# EAGLE design LVDS_CMOS_LVDT41v3 (EAGLE 8.3.2)
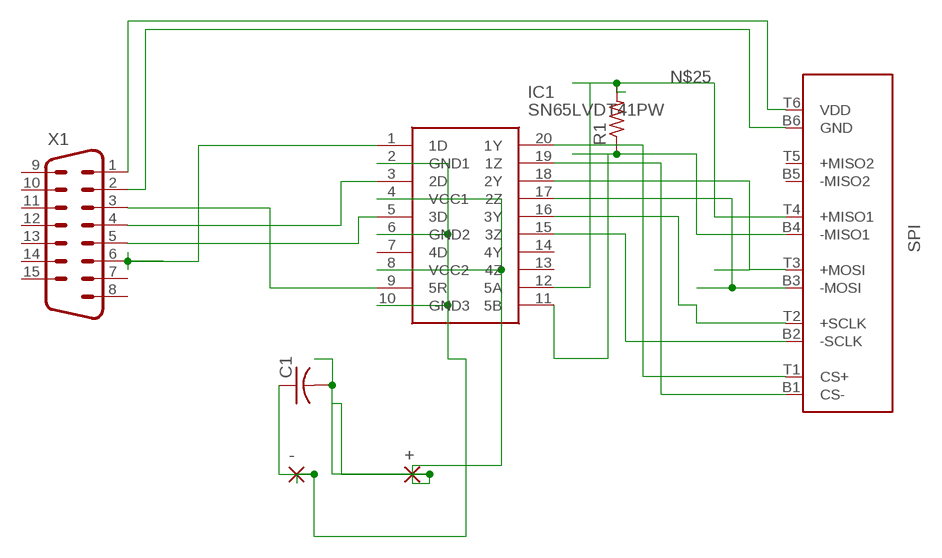
[diagram p0: schematic, sheet 1]

## Parts
+  3,17/1,3  [3,17/1,3]
-  3,17/1,3  [3,17/1,3]
C1  C-USC0805  [C0805]
IC1  SN65LVDT41PW  [SOP65P640X120-20N]
R1  R-US_R0603  [R0603]
SPI  SPI  OMNETICS-CONNECTOR-SLAVE-SIDE  [OMNETICS_PZN-12-AA-UPDATED]
X1  M15H  [M15H]

## Nets
BRD_GND [power]: -.1(P) C1.1 IC1.2(GND1) IC1.6(GND2) IC1.10(GND3)
N$1: SPI.T6(VDD) X1.1
N$2: SPI.B6(GND) X1.2
N$4: IC1.1(1D) X1.6
N$5: IC1.9(5R) X1.3
N$6: IC1.3(2D) X1.4
N$7: IC1.5(3D) X1.5
N$21: IC1.16(3Y) SPI.T2(+SCLK)
N$22: IC1.15(3Z) SPI.B2(-SCLK)
N$23: IC1.18(2Y) SPI.T3(+MOSI)
N$24: IC1.17(2Z) SPI.B3(-MOSI)
N$25: IC1.12(5A) R1.2 SPI.T4(+MISO1)
N$26: IC1.11(5B) R1.1 SPI.B4(-MISO1)
N$43: IC1.19(1Z) SPI.B1(CS-)
N$44: IC1.20(1Y) SPI.T1(CS+)
VDD-3.3V [power]: +.1(P) C1.2 IC1.4(VCC1) IC1.8(VCC2)
Unconnected: IC1.7(4D) IC1.13(4Z) IC1.14(4Y) SPI.B5(-MISO2) SPI.T5(+MISO2) X1.7 X1.8 X1.9 X1.10 X1.11 X1.12 X1.13 X1.14 X1.15

## Library data of the parts
+ - = wirepad:3,17/1,3: THROUGH-HOLE PAD
C1 = resistor:C-US: CAPACITOR, American symbol
IC1 = SamacSys_Parts:SN65LVDT41PW: Texas Instruments SN65LVDT41PW, LVDS Transceiver, 3 3.6 V, 20-Pin, TSSOP Source: Datasheet <http://www.ti.com/lit/gpn/sn65lvdt41>; ARROW_PART_NUMBER: SN65LVDT41PW; ARROW_PRICE/STOCK: https://www.arrow.com/en/products/sn65lvdt41pw/texas-instruments; DESCRIPTION: Texas Instruments SN65LVDT41PW, LVDS Transceiver, 3 3.6 V, 20-Pin, TSSOP; HEIGHT: 1.2mm; MANUFACTURER_NAME: Texas Instruments; MANUFACTURER_PART_NUMBER: SN65LVDT41PW; RS_PART_NUMBER: 1625262; RS_PRICE/STOCK: http://uk.rs-online.com/web/p/products/1625262
R1 = resistor:R-US_: RESISTOR, American symbol
SPI = headstage_isolation_board_3:OMNETICS-CONNECTOR-SLAVE-SIDE; OC_NEWARK: unknown
X1 = con-subd:M15: SUB-D; OC_FARNELL: unknown; OC_NEWARK: unknown

## Net classes
0 default: width 0.203 mm, drill 0.254 mm
1 power: width 0.381 mm

## Board
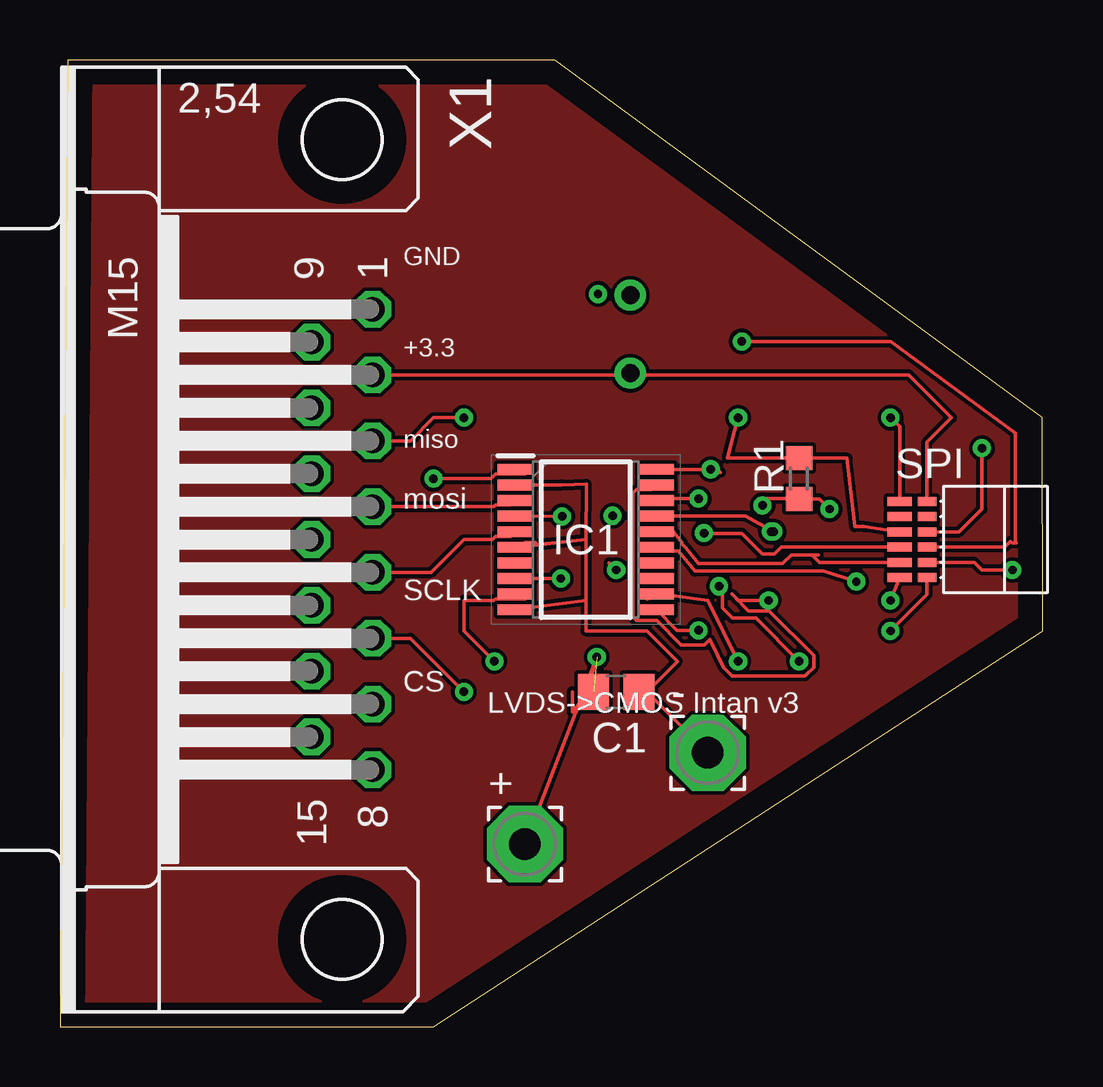
[diagram p1: board, top side]
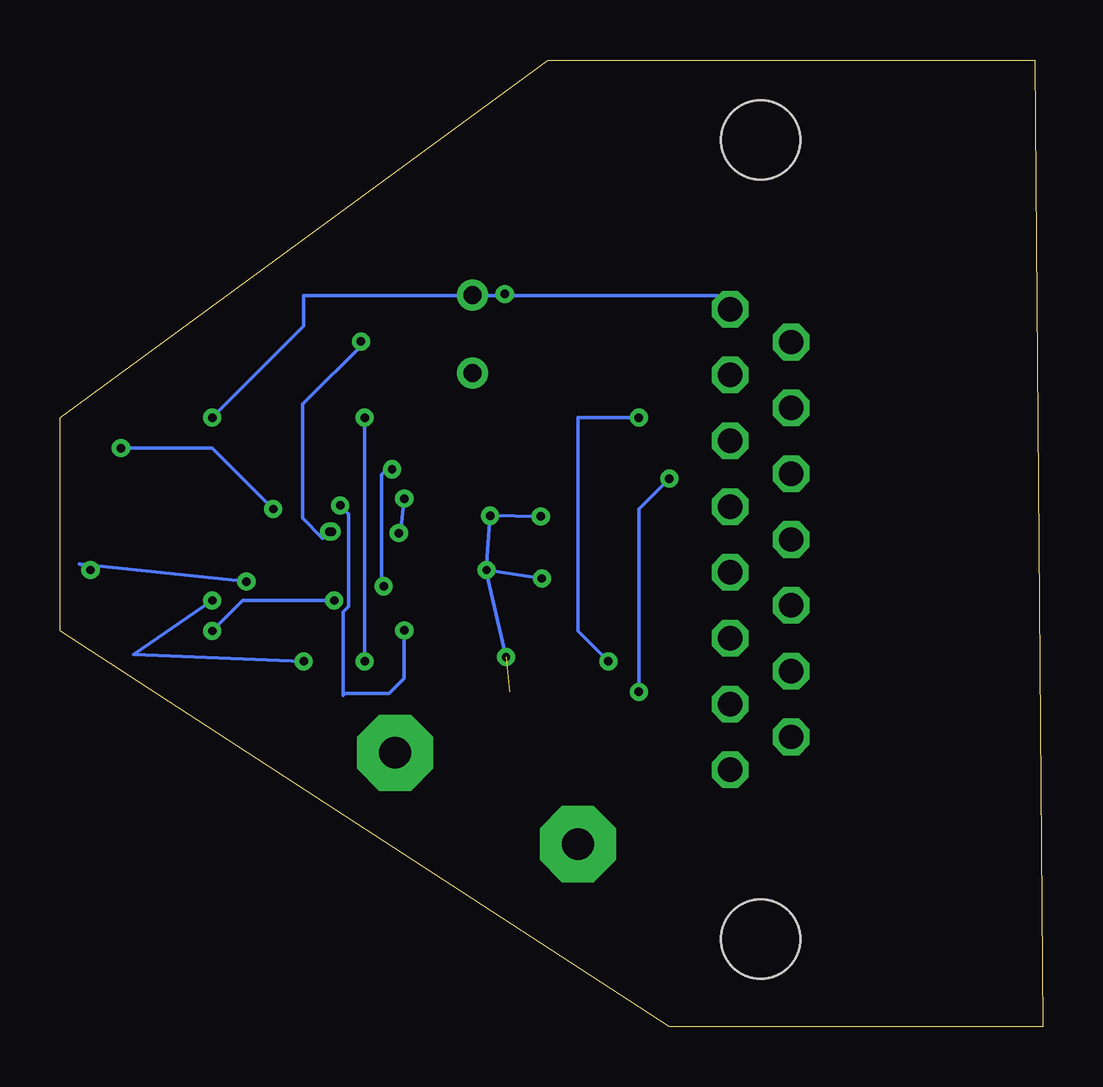
[diagram p2: board, bottom side, seen from below]

Size 40.97 x 40.31 mm. Coordinates in mm from the lower left corner, seen from the top.
Outline: 40.97,16.51 40.95,25.4 20.63,40.31 0.33,40.31 0,0 15.57,0 40.97,16.51
Copper layers (1*16): Top 0.035mm / dielectric 1.5mm / Bottom 0.035mm
Design rules "default": minimum track width 6mil, minimum drill 0.35mm, track to track 6mil, track to pad 6mil, pad to pad 6mil, via to via 6mil, smd to smd 6mil, copper to edge 40mil, drill to drill 6mil, minimum pad ring 10mil, minimum via ring 8mil, stop-mask expansion 4mil, vias tented up to drill 0mil, thermal gap 10mil

### Footprints (pad centres in the part's own frame; a part is rotated, then mirrored left to right if it is on the bottom)
3,17/1,3 = drill 1.321 pad 3.175 octagon: 1 0,0
C0805 = smd 1.3 x 1.5: 1 -0.95,0; 2 0.95,0
SOP65P640X120-20N = smd 1.475 x 0.45: 1 -2.938,2.925; 2 -2.938,2.275; 3 -2.938,1.625; 4 -2.938,0.975; 5 -2.938,0.325; 6 -2.938,-0.325; 7 -2.938,-0.975; 8 -2.938,-1.625; 9 -2.938,-2.275; 10 -2.938,-2.925; 11 2.938,-2.925; 12 2.938,-2.275; 13 2.938,-1.625; 14 2.938,-0.975; 15 2.938,-0.325; 16 2.938,0.325; 17 2.938,0.975; 18 2.938,1.625; 19 2.938,2.275; 20 2.938,2.925
R0603 = smd 1 x 1.1: 1 -0.85,0; 2 0.85,0
OMNETICS_PZN-12-AA-UPDATED = smd 0.381 x 0.762: B1 1.587,-1.016; B2 0.953,-1.016; B3 0.318,-1.016; B4 -0.318,-1.016; B5 -0.953,-1.016; B6 -1.587,-1.016 | smd 0.381 x 1.016: T1 1.587,-2.159; T2 0.953,-2.159; T3 0.318,-2.159; T4 -0.318,-2.159; T5 -0.953,-2.159; T6 -1.587,-2.159
M15H = drill 1.016 octagon: 1 -9.601,1.27; 2 -6.858,1.27; 3 -4.115,1.27; 4 -1.372,1.27; 5 1.372,1.27; 6 4.115,1.27; 7 6.858,1.27; 8 9.601,1.27; 9 -8.23,-1.27; 10 -5.486,-1.27; 11 -2.743,-1.27; 12 0,-1.27; 13 2.743,-1.27; 14 5.486,-1.27; 15 8.23,-1.27 | hole 3.302: 16.662,0; -16.662,0

### Placement (x,y rotation side)
+  19.38,7.62 0 top
-  27,11.43 0 top
C1  23.19,13.97 180 top
IC1  21.92,20.32 0 top
R1  30.81,22.86 90 top
SPI  37.16,20.32 270 top
X1  11.76,20.32 270 top

### Tracks (layer width: path | path; a pad name or v marks a point on that pad's centre or on a via)
BRD_GND
  Top 0.152: IC1.2 20.91,22.59 21.94,22.63 21.92,20.32 | 21.92,20.32 21.92,17.78 | 21.92,17.78 21.92,16.51 24.46,16.51 25.73,15.24 24.46,13.97 | C1.1 24.46,13.97 | 24.46,13.97 -.1 | 19.38,20.19 19.81,20.19 19.46,20.07 21.92,20.32 | IC1.6 21.92,20.32 | 21.92,17.78 IC1.10
N$1  (via drill 0.35)
  Top 0.152: SPI.T6 35,25.02 v34.62,25.4
  Bottom 0.152: v34.62,25.4 30.81,29.21 30.81,30.48 13.59,30.48 X1.1
N$2
  Top 0.152: SPI.B6 36.14,24.38 37.16,25.4 35.38,27.18 X1.2
N$3
  pour Top: 0.33,40.64 0.33,0 15.57,0 40.97,16.51 40.97,25.4 19.38,40.64
N$4  (via drill 0.35)
  Top 0.152: X1.6 14.6,16.2 v16.84,13.97 | IC1.1 19.18,23.05 19.38,23.05 18.15,23.05 17.96,22.86 v15.57,22.86
  Bottom 0.152: v16.84,13.97 16.84,21.59 v15.57,22.86
N$5  (via drill 0.35)
  Top 0.152: X1.3 14.6,24.43 15.57,25.4 v16.84,25.4 | v18.11,15.24 16.84,16.51 16.84,17.78 18.08,17.78 18.15,17.85 19.38,17.85 19.18,17.85 IC1.9
  Bottom 0.152: v16.84,25.4 19.38,25.4 19.38,16.51 v18.11,15.24
N$6
  Top 0.152: X1.4 18.09,21.69 18.15,21.75 18.79,21.75 IC1.3
N$7
  Top 0.152: X1.5 15.47,18.95 16.84,20.32 18.02,20.32 18.15,20.45 18.79,20.45 IC1.5
N$9  (via drill 0.35)
  other vias: 22.43,30.56
N$10  (via drill 0.75 pad 1.3)
  other vias: 23.77,27.25 23.77,30.51
N$21
  Top 0.152: IC1.16 24.98,20.6 25.54,20.7 25.94,20.2 25.94,20.13 26.01,20.04 26.09,19.96 26.61,19.33 30.12,19.33 30.48,19.68 31.34,19.68 | 31.34,19.68 31.61,19.68 | 31.34,19.68 31.66,19.37 SPI.T2
N$22  (via drill 0.35)
  Top 0.152: v39.7,19.05 38.43,19.05 38.11,19.37 SPI.B2 | v33.2,18.56 31.83,19 26.47,19 25.78,19.84 25.2,19.84 25.04,19.99 IC1.15
  Bottom 0.152: v33.2,18.56 40.16,19.3 v39.7,19.05
N$23  (via drill 0.35)
  Top 0.152: SPI.T3 30.08,20 29.79,19.71 29.29,19.71 28.43,20.57 26.82,20.57 26.75,20.65 v26.85,20.59 | IC1.18 24.94,22.02 v26.62,22.02
  Bottom 0.152: v26.85,20.59 26.77,20.59 v26.62,22.02 26.42,21.92
N$24  (via drill 0.35)
  Top 0.152: 29.32,20.7 v29.74,20.65 | SPI.B3 39.38,20 39.62,20.24 39.69,20.18 39.87,20.18 39.83,20.22 39.83,24.77 34.63,28.58 v28.42,28.58 | v29.74,20.65 28.56,21.29 IC1.17 | v29.74,20.65 v29.64,20.65
  Bottom 0.152: v29.64,20.65 30.02,20.37 30.86,21.21 30.86,25.96 28.22,28.6 28.4,28.6 v28.42,28.58
N$25  (via drill 0.35)
  Top 0.152: SPI.T4 33.52,20.85 33.13,20.85 32.81,23.71 R1.2 27.83,23.71 v28.27,25.4 | v28.27,15.24 27,17.78 25.66,17.96 25.44,18 24.46,17.85 IC1.12
  Bottom 0.152: v28.27,25.4 v28.27,15.24
N$26  (via drill 0.35)
  Top 0.152: SPI.B4 37.48,20.64 38.43,21.59 v38.43,24.13 | v32.08,21.59 31.66,22.01 R1.1 | R1.1 30.39,22.01 | R1.1 30.8,22.02 29.36,22.02 29.29,21.95 v29.29,21.74 | IC1.11 25.72,16.53 v26.62,16.53
  Bottom 0.152: v38.43,24.13 34.62,24.13 v32.08,21.59 | v29.29,21.74 28.93,21.39 28.93,17.53 29.16,17.3 29.16,13.82 29.08,13.89 27.25,13.89 26.62,14.53 v26.62,16.53 | v26.62,16.53 26.62,16.59 v26.62,16.53
N$43  (via drill 0.35)
  Top 0.152: SPI.B1 36.14,18.03 v34.62,16.51 | v29.54,17.78 28.27,17.78 28.09,17.96 | 28.09,17.96 28,18.04 | 28.09,17.96 28.7,17.35 29.56,17.35 31.42,15.49 31.42,14.99 31.06,14.63 28.02,14.63 27.66,14.99 27.09,16.14 26.87,15.93 25.89,15.93 24.88,16.94 24.03,16.94 23.89,17.07 23.89,22.27 24.03,22.4 24.66,22.4 IC1.19
  Bottom 0.152: v34.62,16.51 33.35,17.78 v29.54,17.78
N$44  (via drill 0.35)
  Top 0.152: v34.62,17.78 SPI.T1 | v30.81,15.24 29.01,17.04 28.04,17.04 27.61,17.47 27.61,18.29 27.52,18.37 v27.47,18.37 | 27.53,23.11 27.4,23.24 v27.13,23.24 IC1.20
  Bottom 0.152: v30.81,15.24 37.9,15.52 v34.62,17.78 | v27.47,18.37 27.56,18.46 27.56,23.04 27.35,23.24 v27.13,23.24
VDD-3.3V  (via drill 0.35)  (1 unrouted)
  Top 0.152: +.1 v22.38,15.42 21.92,13.84 21.36,13.12 21.36,13.97 | 22.89,19.34 v23.19,19.05 | v20.88,18.69 IC1.8 | IC1.4 v20.93,21.28
  Bottom 0.152: 23.21,19.01 v23.04,21.31 v20.93,21.28 | 23.21,19.01 v22.38,15.42 | 23.21,19.01 22.98,19.26 v23.19,19.05 v20.88,18.69

### Text on the board
tNames: GND | +3.3 | miso | mosi | SCLK | CS | LVDS->CMOS Intan v3
tValues: o